# Altium schematic sheet WL_CON.SchDoc
size 420 x 297 mm; SheetNumber: 5; SheetTotal: 9
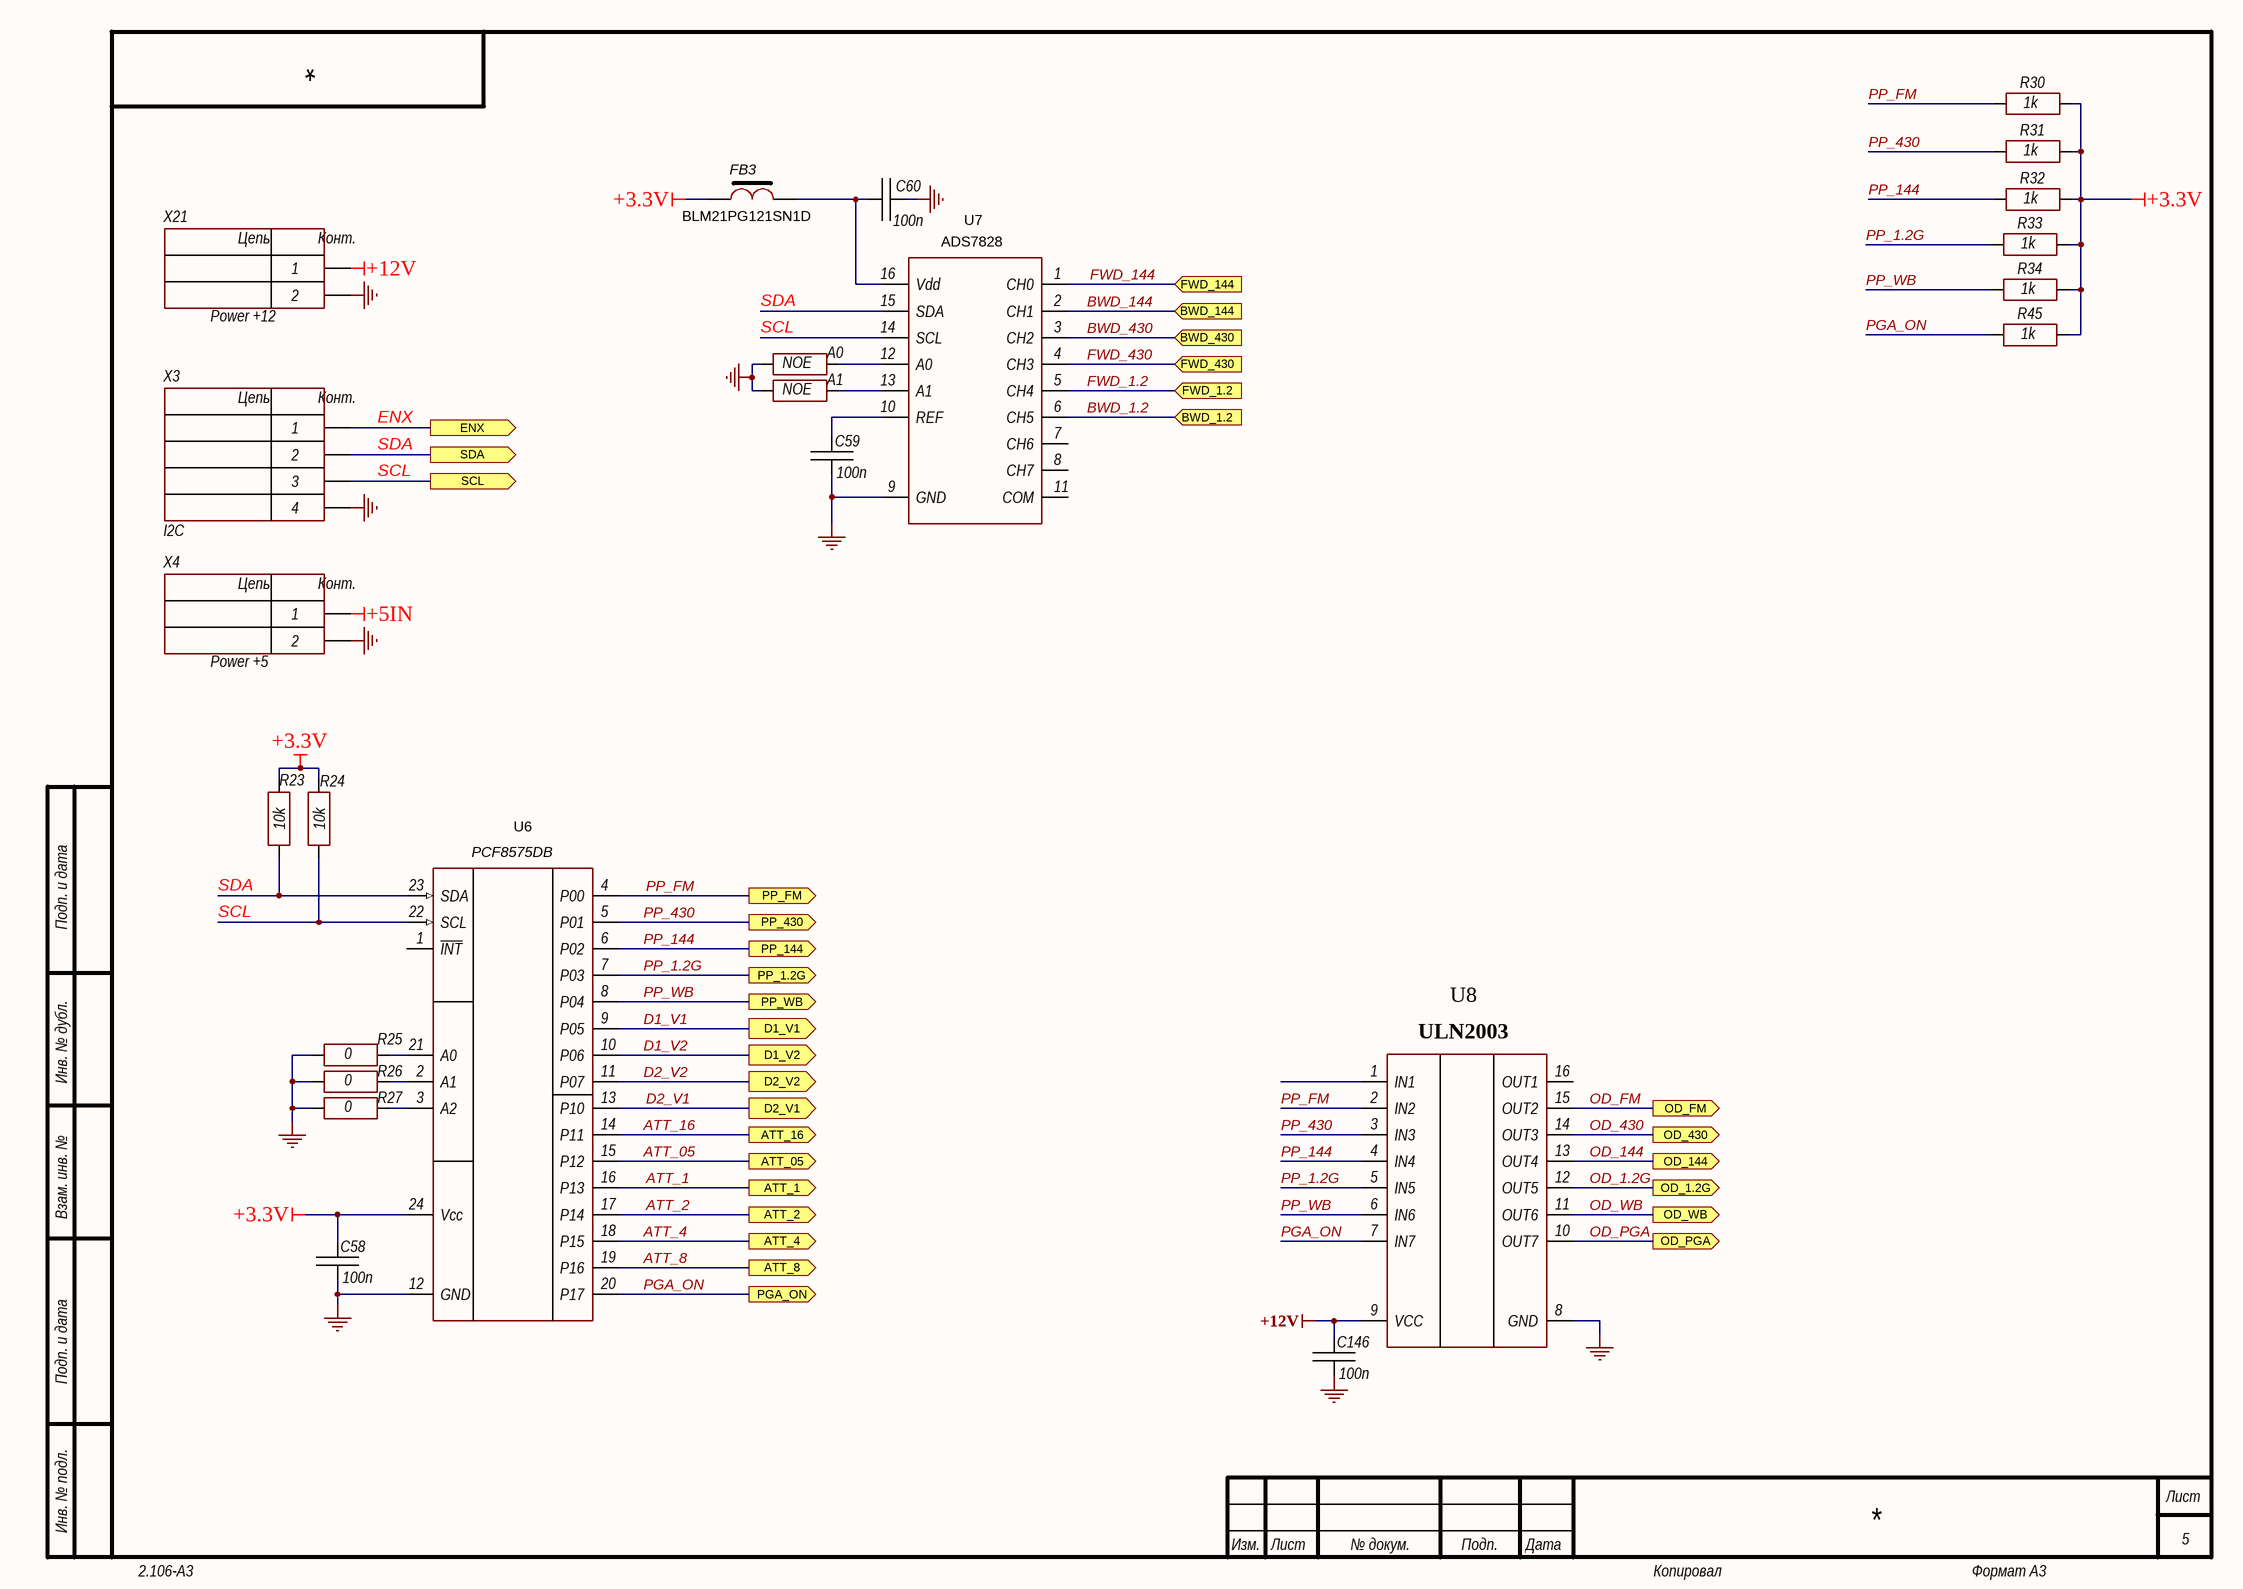
[diagram p0: WL_CON.SchDoc]

## Parts
A0  NOE  [CH0805R]
A1  NOE  [CH0805R]
C58  100n  [CH0805C]
C59  100n  [CH0805C]
C60  100n  [CH0805C]
C146  100n  [CH0805C]
FB3  BLM21PG121SN1D  [CH0805L]
R23  10k  [CH0805R]
R24  10k  [CH0805R]
R25  0  [CH0805R]
R26  0  [CH0805R]
R27  0  [CH0805R]
R30  1k  [CH0603R]
R31  1k  [CH0603R]
R32  1k  [CH0603R]
R33  1k  [CH0603R]
R34  1k  [CH0603R]
R45  1k  [CH0603R]
U6  PCF8575DB  [24-TSSOP_HIR]
U7  ADS7828  [16-SSOP]
U8  ULN2003  [16-SOIC]
X3  I2C  [CON: CWF-4]
X4  Power +5  [CON: CWF-2]
X21  Power +12  [CON: CWF-2]

## Ports
ATT_1 (out), ATT_2 (out), ATT_4 (out), ATT_05 (out), ATT_8 (out), ATT_16 (out), BWD_1.2 (in), BWD_144 (in), BWD_430 (in), D1_V1 (out), D1_V2 (out), D2_V1 (out), D2_V2 (out), ENX (out), FWD_1.2 (in), FWD_144 (in), FWD_430 (in), OD_1.2G (out), OD_144 (out), OD_430 (out), OD_FM (out), OD_PGA (out), OD_WB (out), PGA_ON (out), PP_1.2G (out), PP_144 (out), PP_430 (out), PP_FM (out), PP_WB (out), SCL (out), SDA (out)

## Nets
+3.3V: C58.2 FB3.1 R23.1 R24.1 R30.2 R31.2 R32.2 R33.2 R34.2 R45.2 U6.24(Vcc)
+5IN: X4.1
+12V: C146.2 U8.9(VCC) X21.1
GND: A0.1 A1.1 C58.1 C59.1 C60.1 C146.1 R25.1 R26.1 R27.1 U6.12(GND) U7.9(GND) U8.8(GND) X3.4 X4.2 X21.2
ATT_1: U6.16(P13) ; port ATT_1
ATT_2: U6.17(P14) ; port ATT_2
ATT_4: U6.18(P15) ; port ATT_4
ATT_05: U6.15(P12) ; port ATT_05
ATT_8: U6.19(P16) ; port ATT_8
ATT_16: U6.14(P11) ; port ATT_16
BWD_1.2: U7.6(CH5) ; port BWD_1.2
BWD_144: U7.2(CH1) ; port BWD_144
BWD_430: U7.3(CH2) ; port BWD_430
D1_V1: U6.9(P05) ; port D1_V1
D1_V2: U6.10(P06) ; port D1_V2
D2_V1: U6.13(P10) ; port D2_V1
D2_V2: U6.11(P07) ; port D2_V2
ENX: X3.1 ; port ENX
FWD_1.2: U7.5(CH4) ; port FWD_1.2
FWD_144: U7.1(CH0) ; port FWD_144
FWD_430: U7.4(CH3) ; port FWD_430
OD_1.2G: U8.12(OUT5) ; port OD_1.2G
OD_144: U8.13(OUT4) ; port OD_144
OD_430: U8.14(OUT3) ; port OD_430
OD_FM: U8.15(OUT2) ; port OD_FM
OD_PGA: U8.10(OUT7) ; port OD_PGA
OD_WB: U8.11(OUT6) ; port OD_WB
PGA_ON: R45.1 U6.20(P17) U8.7(IN7) ; port PGA_ON
PP_1.2G: R33.1 U6.7(P03) U8.5(IN5) ; port PP_1.2G
PP_144: R32.1 U6.6(P02) U8.4(IN4) ; port PP_144
PP_430: R31.1 U6.5(P01) U8.3(IN3) ; port PP_430
PP_FM: R30.1 U6.4(P00) U8.2(IN2) ; port PP_FM
PP_WB: R34.1 U6.8(P04) U8.6(IN6) ; port PP_WB
SCL: R24.2 U6.22(SCL) U7.14(SCL) X3.3 ; port SCL
SDA: R23.2 U6.23(SDA) U7.15(SDA) X3.2 ; port SDA
NetA0_2: A0.2 U7.12(A0)
NetA1_2: A1.2 U7.13(A1)
NetC59_2: C59.2 U7.10(REF)
NetC60_2: C60.2 FB3.2 U7.16(Vdd)
NetR25_2: R25.2 U6.21(A0)
NetR26_2: R26.2 U6.2(A1)
NetR27_2: R27.2 U6.3(A2)

Not connected (* = marked no-connect by the designer): U6 1(~{INT}); U7 7(CH6) 8(CH7) 11(COM); U8 1(IN1) 16(OUT1)

## Notes on the sheet
- Подп. и дата
- Инв. № дубл.
- Взам. инв. №
- Инв. № подл.
- Изм.
- Лист
- № докум.
- Подп.
- Дата
- 2.106-A3
- Копировал
- Формат А3
- (in symbol 2-Connector) Цепь; Конт.
- (in symbol 4-Connector) Цепь; Конт.

## Library data of the parts
A0 A1 R23-R27 R30-R34 R45 = Resistor: Manufacturer: *; Model: *; HelpURL: *; ComponentKind: *; Value: *
C58-C60 C146 = Capacitor: Manufacturer: *; Model: *; HelpURL: *; ComponentKind: *; Value: *
FB3 = FB-1
U6 = PCF8575
U8 = ULN2003_NEW
X3 = 4-Connector: Model: *; Manufacturer: *; HelpURL: *; ComponentKind: *
X4 X21 = 2-Connector: Model: *; Manufacturer: *; HelpURL: *; ComponentKind: *